# Altium schematic sheet Motor-E.SchDoc: Motor-E
size Letter; SheetNumber: 12; SheetTotal: 12
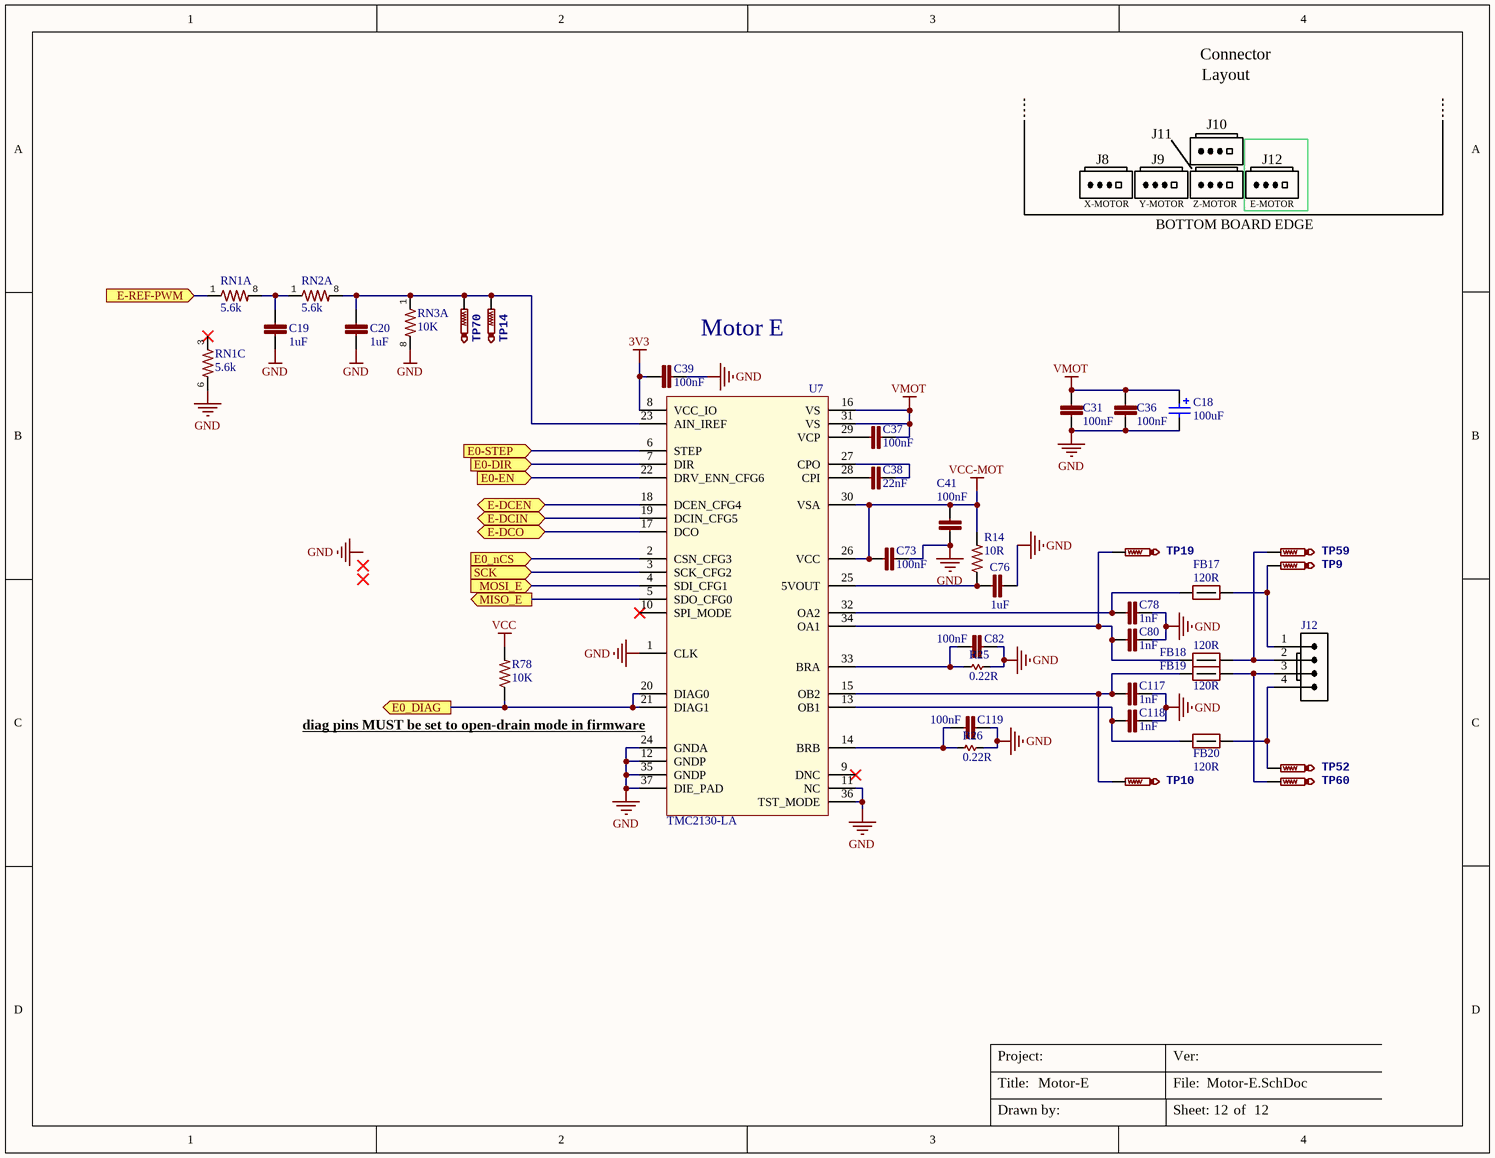
[diagram p0: Motor-E.SchDoc]

## Parts
C18  value 100uF  [CAP-ELEC-063063077]  (hidden comment: UWT1V101MCL1GS)
C19  1uF  [C0402]
C20  1uF  [C0402]
C31  100nF  [C0603]
C36  100nF  [C0603]
C37  100nF  [C0603]
C38  22nF  [C0402]
C39  100nF  [C0402]
C41  100nF  [C0402]
C73  100nF  [C0402]
C76  1uF  [C0402]
C78  1nF  [C0603]
C80  1nF  [C0603]
C82  100nF  [C0603]
C117  1nF  [C0603]
C118  1nF  [C0603]
C119  100nF  [C0603]
FB17  120R  [FB0603]
FB18  120R  [FB0603]
FB19  120R  [FB0603]
FB20  120R  [FB0603]
J12  Molex 0705430003  [4POL254]  (value not drawn)
R14  10R  [R0402]
R25  0.22R  [R1206]
R26  0.22R  [R1206]
R78  10K  [R0402]
RN1  5.6k  [CAY16]  (parts A,C of 4)
RN2  5.6k  [CAY16]  (part A of 4)
RN3  10K  [CAY16]  (part A of 4)
TP9  TestPoint  [TP1-27]  (value not drawn)  (no BOM)
TP10  TestPoint  [TP1-27]  (value not drawn)  (no BOM)
TP14  TestPoint  [TP1-27]  (value not drawn)  (no BOM)
TP19  TestPoint  [TP1-27]  (value not drawn)  (no BOM)
TP52  TestPoint  [TP1-27]  (value not drawn)  (no BOM)
TP59  TestPoint  [TP1-27]  (value not drawn)  (no BOM)
TP60  TestPoint  [TP1-27]  (value not drawn)  (no BOM)
TP70  TestPoint  [TP1-27]  (value not drawn)  (no BOM)
U7  TMC2130-LA  [QFN36-50P500X600X900_HS-37N]

## Ports
E0-DIR, E0-EN, E0-STEP, E0_DIAG, E0_nCS, E-DCEN, E-DCIN, E-DCO, E-REF-PWM, MISO_E, MOSI_E, SCK

## Nets
3V3: C39.2 U7.8(VCC_IO)
GND: C18.2 C19.2 C20.2 C31.1 C36.1 C39.1 C41.1 C73.1 C76.2 C78.2 C80.2 C82.1 C117.2 C118.2 C119.1 R25.2 R26.2 RN1.6 RN3.8 U7.1(CLK) U7.11(NC) U7.12(GNDP) U7.24(GNDA) U7.35(GNDP) U7.36(TST_MODE) U7.37(DIE_PAD)
VCC: R78.2
VCC-MOT: C41.2 C73.2 R14.2 U7.26(VCC) U7.30(VSA)
VMOT: C18.1 C31.2 C36.2 C37.2 U7.16(VS) U7.31(VS)
E0-DIR: U7.7(DIR) ; port E0-DIR
E0-EN: U7.22(DRV_ENN_CFG6) ; port E0-EN
E0-STEP: U7.6(STEP) ; port E0-STEP
E0_DIAG: R78.1 U7.20(DIAG0) U7.21(DIAG1) ; port E0_DIAG
E0_nCS: U7.2(CSN_CFG3) ; port E0_nCS
E-DCEN: U7.18(DCEN_CFG4) ; port E-DCEN
E-DCIN: U7.19(DCIN_CFG5) ; port E-DCIN
E-DCO: U7.17(DCO) ; port E-DCO
E-REF-PWM: RN1.1 ; port E-REF-PWM
MISO_E: U7.5(SDO_CFG0) ; port MISO_E
MOSI_E: U7.4(SDI_CFG1) ; port MOSI_E
SCK: U7.3(SCK_CFG2) ; port SCK
NetC19_1: C19.1 RN1.8 RN2.1
NetC20_1: C20.1 RN2.8 RN3.1 TP14.TP TP70.TP U7.23(AIN_IREF)
NetC37_1: C37.1 U7.29(VCP)
NetC38_1: C38.1 U7.28(CPI)
NetC38_2: C38.2 U7.27(CPO)
NetC76_1: C76.1 R14.1 U7.25(5VOUT)
NetC78_1: C78.1 FB17.1 U7.32(OA2)
NetC80_1: C80.1 FB18.1 TP19.TP U7.34(OA1)
NetC82_2: C82.2 R25.1 U7.33(BRA)
NetC117_1: C117.1 FB19.1 TP10.TP U7.15(OB2)
NetC118_1: C118.1 FB20.1 U7.13(OB1)
NetC119_2: C119.2 R26.1 U7.14(BRB)
NetFB17_2: FB17.2 J12.1 TP9.TP
NetFB18_2: FB18.2 J12.2 TP59.TP
NetFB19_2: FB19.2 J12.3 TP60.TP
NetFB20_2: FB20.2 J12.4 TP52.TP

Not connected (* = marked no-connect by the designer): RN1 3(1)*; U7 9(DNC)* 10(SPI_MODE)*

## Notes on the sheet
- Connector
- Layout
- J8
- J9
- J11
- J10
- J12
- X-MOTOR
- Y-MOTOR
- BOTTOM BOARD EDGE
- Z-MOTOR
- E-MOTOR
- Motor E
- (near U7) diag pins MUST be set to open-drain mode in firmware
- Labels drawn without touching a wire or pin: GND
- Title:
- Project:
- File:
- Ver:
- Drawn by:
- Sheet:
- of

## Library data of the parts
C18 = UWT1V101MCL1GS: CAP ALUM 100UF 35V 20% SMD; Manufacturer: Nichicon; Part Description: 100µF 35V Aluminum Capacitors Radial, Can - SMD 1000 Hrs @ 105°C; EE_SPEC: 100uF 35V Al-El; Tolerance: +/- 20%; MANUFACTURER #: UWT1V101MCL1GS; DISTRIBUTOR #: 493-2203-2-ND; DISTRIBUTOR: Digi-Key; PART: 100uF
C19 C20 C76 = GRM155R60J105KE19D: CAP CER 0402 1uF 6.3V 10% X5R; Manufacturer: Murata; Part Description: 1µF ±10% 6.3V Ceramic Capacitor X5R 0402 (1005 Metric); EE_SPEC: 1uF 6.3V X5R 0402; Tolerance: +/- 10%; VALUE: 1uF; MANUFACTURER #: GRM155R60J105KE19D; DISTRIBUTOR #: 490-1320-2-ND; DISTRIBUTOR: Digi-Key; PART: 1uF
C31 C36 C37 C82 C119 = C0603C104K5RACTU: CAP CER 0603 100nF 50V 10% X7R; Manufacturer: Kemet; Part Description: 0.1µF ±10% 50V Ceramic Capacitor X7R 0603 (1608 Metric); EE_SPEC: 100nF 50V X7R 0603; Tolerance: +/- 10%; VALUE: 100nF; MANUFACTURER #: C0603C104K5RACTU; DISTRIBUTOR #: 399-5089-2-ND; DISTRIBUTOR: Digi-Key; PART: 100nF
C38 = GCM155R71H223KA55D: CAP CER 0402 22nF ±10% 50V X7R; Manufacturer: YAGEO; Part Description: 0.022µF ±10% 50V Ceramic Capacitor X7R 0402 (1005 Metric); EE_SPEC: 22nF 50V X7R 0402; Tolerance: +/- 10%; VALUE: 22nF; MANUFACTURER #: GCM155R71H223KA55D; DISTRIBUTOR #: 490-4763-2-ND; DISTRIBUTOR: Digi-Key; PART: 22nF
C39 C41 C73 = GRM155R71C104KA88D: CAP CER 0402 100nF 16V 10% X7R; Manufacturer: Murata; Part Description: 0.10µF ±10% 16V Ceramic Capacitor X7R 0402 (1005 Metric); EE_SPEC: 100nF 16V X7R 0402; Tolerance: +/- 10%; VALUE: 100nF; MANUFACTURER #: GRM155R71C104KA88D; DISTRIBUTOR #: 490-3261-2-ND; DISTRIBUTOR: Digi-Key; PART: 100nF
C78 C80 C117 C118 = C0603C102K5RACTU: CAP CER 0603  1nF 50v 10% X7R; Manufacturer: Kemet; Part Description: 1000pF ±10% 50V Ceramic Capacitor X7R 0603 (1608 Metric); EE_SPEC: 1nF 50V X7R 0603; Tolerance: +/- 10%; VALUE: 1nF; MANUFACTURER #: C0603C102K5RACTU; DISTRIBUTOR #: 399-1082-2-ND; DISTRIBUTOR: Digi-Key; PART: 1nF
FB17-FB20 = FERRITE 120R 3A 0603: FERRITE BEAD 120 OHM 0603 1LN; MANUFACTURER: Samsung; MANUFACTURER #: CIS10P121AC; VALUE: 120Rfb; TOLERANCE: -NA-; EE_SPEC: 3A; DISTRIBUTOR #: 1276-6351-2-ND; DISTRIBUTOR: Digikey; PART: FERRITE 120R 3A 0603; PART DESCRIPTION: FERRITE BEAD 120 OHM 0603 1LN
J12 = CONN 4PIN 0.1" VERT SHRD LOCK ALT: Molex 4 Pin Clip Connector; MANUFACTURER #: 0705430038; PART: 4 Pin Conn; PART DESCRIPTION: 4 Positions Header, Shrouded Connector 0.100" (2.54mm) Through Hole Tin; TOLERANCE: -NA-; VALUE: HDR4; MANUFACTURER: Molex; DISTRIBUTOR #: WM4826-ND; DISTRIBUTOR: Digi-Key; EE_SPEC: -NA-
R14 = RC0402FR-0710RL: RES SMD 10 OHM 1% 1/16W 0402; Manufacturer: Yageo; Part Description: 10 Ohm ±1% 0.063W, 1/16W Chip Resistor 0402 (1005 Metric) Moisture Resistant Thick Film; EE_SPEC: 10R 1% 0402; Tolerance: +/- 1%; VALUE: 10R; MANUFACTURER #: RC0402FR-0710RL; DISTRIBUTOR #: 311-10.0LRTR-ND; DISTRIBUTOR: Digi-Key; PART: 10R
R25 R26 = 0.22R 1% 1206: RES SMD 0.22 OHM 1% 1/3W 1206; Manufacturer: Panasonic; MANUFACTURER #: RUT3216FR220CS; Tolerance: +/- 1%; DISTRIBUTOR #: RUT3216FR220CS; DISTRIBUTOR: Digi-Key; EE_SPEC: 0.22R 1% 1206; PART: 0.22R; Part Description: RES SMD 0.22 OHM 1% 1/3W 1206; VALUE: 0.22R
R78 = RC0402FR-0710KP: RES SMD 10K OHM 1% 1/16W 0402; MANUFACTURER: Yageo; PART: 10k 1% 0402; PART DESCRIPTION: 10k Ohm ±1% 0.063W, 1/16W Chip Resistor 0402 (1005 Metric) Moisture Resistant Thick Film; EE_SPEC: 10k 1% 0402 1/16W; VALUE: 10K; MANUFACTURER #: RC0402FR-0710KP; DISTRIBUTOR #: YAG1249TR-ND; DISTRIBUTOR: Digi-Key; TOLERANCE: 1%
RN1 RN2 = 5.6k x 4 5% 1206: RES ARRAY 4 RES 5.6K OHM 1206; Manufacturer: Bourns; MANUFACTURER #: CAY16-562J4LF; Part Description: 5.6k Ohm ±5% 62.5mW Power Per Element Isolated Resistor Network/Array ±200ppm/°C 1206 (3216 Metric), Convex, Long Side Terminals; Tolerance: +/- 5%; VALUE: 5.6k; DISTRIBUTOR #: CAY16-562J4LFCT-ND; DISTRIBUTOR: Digi-Key; EE_SPEC: 5.6k x 4 5% 1206; PART: 5.6k
RN3 = CAY16-103J4LF: RES ARRAY 4 RES 10K 1206 62.5mW 5%; Manufacturer: Bourns; Part Description: 10k Ohm ±5% 62.5mW Power Per Element Isolated Resistor Network/Array ±200ppm/°C 1206 (3216 Metric), Convex, Long Side Terminals; EE_SPEC: 10k 5% Array_x_4; Tolerance: +/- 5%; VALUE: 10K; MANUFACTURER #: CAY16-103J4LF; DISTRIBUTOR #: CAY16-103J4LFTR-ND; DISTRIBUTOR: Digi-Key; PART: 10K
TP9 TP10 TP14 TP19 TP52 TP59 TP60 TP70 = TestPoint: Test Point
U7 = TMC2130-LA-T: IC STEPPER MOTOR DVR SPI 36QFN; MANUFACTURER: Trinamic; Part Description: Bipolar Motor Driver Power MOSFET SPI, Step/Direction 36-QFN (5x6); EE_SPEC: 46V 1.2A 1/256 Step; Tolerance: NA; DISTRIBUTOR #: 1460-1130-2-ND; DISTRIBUTOR: Digi-Key; MANUFACTURER #: TMC2130-LA-T; PART: TMC2130; VALUE: TMC2130